# Altium schematic sheet thermopile.SchDoc
size A
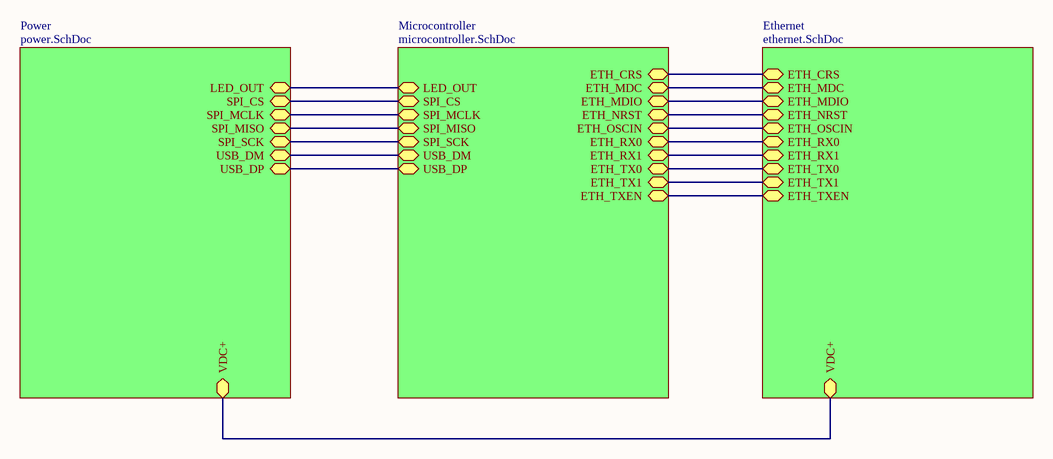
[diagram p0: thermopile.SchDoc]

## Sub-sheets
Ethernet = ethernet.SchDoc: ETH_CRS, ETH_MDC, ETH_MDIO, ETH_NRST, ETH_OSCIN, ETH_RX0, ETH_RX1, ETH_TX0, VDC+, ETH_TX1, ETH_TXEN
Microcontroller = microcontroller.SchDoc: ETH_CRS, ETH_MDC, ETH_MDIO, ETH_NRST, ETH_OSCIN, ETH_RX0, ETH_RX1, ETH_TX0, USB_DM, SPI_SCK, SPI_MISO, SPI_MCLK, SPI_CS, LED_OUT, ETH_TXEN, ETH_TX1, USB_DP
Power = power.SchDoc: USB_DM, SPI_SCK, SPI_MISO, SPI_MCLK, SPI_CS, LED_OUT, USB_DP, VDC+

## Nets
(unnamed): sheet Microcontroller/ETH_CRS, sheet Ethernet/ETH_CRS
(unnamed): sheet Microcontroller/ETH_MDC, sheet Ethernet/ETH_MDC
(unnamed): sheet Microcontroller/ETH_MDIO, sheet Ethernet/ETH_MDIO
(unnamed): sheet Microcontroller/ETH_NRST, sheet Ethernet/ETH_NRST
(unnamed): sheet Microcontroller/ETH_OSCIN, sheet Ethernet/ETH_OSCIN
(unnamed): sheet Microcontroller/ETH_RX0, sheet Ethernet/ETH_RX0
(unnamed): sheet Microcontroller/ETH_RX1, sheet Ethernet/ETH_RX1
(unnamed): sheet Microcontroller/ETH_TX0, sheet Ethernet/ETH_TX0
(unnamed): sheet Microcontroller/USB_DM, sheet Power/USB_DM
(unnamed): sheet Microcontroller/SPI_SCK, sheet Power/SPI_SCK
(unnamed): sheet Microcontroller/SPI_MISO, sheet Power/SPI_MISO
(unnamed): sheet Microcontroller/SPI_MCLK, sheet Power/SPI_MCLK
(unnamed): sheet Microcontroller/SPI_CS, sheet Power/SPI_CS
(unnamed): sheet Microcontroller/LED_OUT, sheet Power/LED_OUT
(unnamed): sheet Microcontroller/ETH_TXEN, sheet Ethernet/ETH_TXEN
(unnamed): sheet Microcontroller/ETH_TX1, sheet Ethernet/ETH_TX1
(unnamed): sheet Microcontroller/USB_DP, sheet Power/USB_DP
(unnamed): sheet Power/VDC+, sheet Ethernet/VDC+